# Altium schematic sheet power_supply.SchDoc
size A4
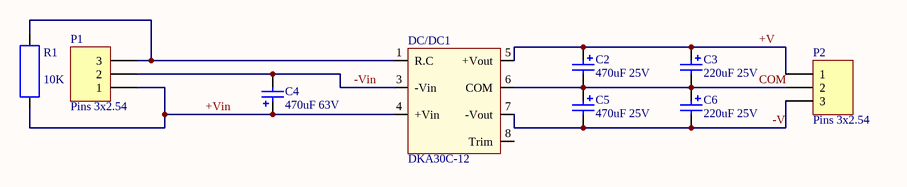
[diagram p0: power_supply.SchDoc]

## Parts
C2  470uF 25V  [Cond 10mm 25V]
C3  220uF 25V  [Cond 8mm 25V]
C4  470uF 63V  [Cond 12mm 63V]
C5  470uF 25V  [Cond 10mm 25V]
C6  220uF 25V  [Cond 8mm 25V]
DC/DC1  DKA30C-12  [MW_DKA30C-12]
P1  Pins 3x2.54  [Pins 3x2.54]
P2  Pins 3x2.54  [Pins 3x2.54]
R1  10K  [R0805]

## Nets
+V: C2.1 C3.1 DC/DC1.5(+Vout) P2.1
+Vin: C4.1 DC/DC1.4(+Vin) P1.1 R1.1
-V: C5.2 C6.2 DC/DC1.7(-Vout) P2.3
-Vin: C4.2 DC/DC1.3(-Vin) P1.2
COM: C2.2 C3.2 C5.1 C6.1 DC/DC1.6(COM) P2.2
NetDC/DC1_1: DC/DC1.1(R.C) P1.3 R1.2

Not connected (* = marked no-connect by the designer): DC/DC1 8(Trim)

## Library data of the parts
C2-C6 = Cond_polar
DC/DC1 = MW_DKA30C-12
R1 = Resistor